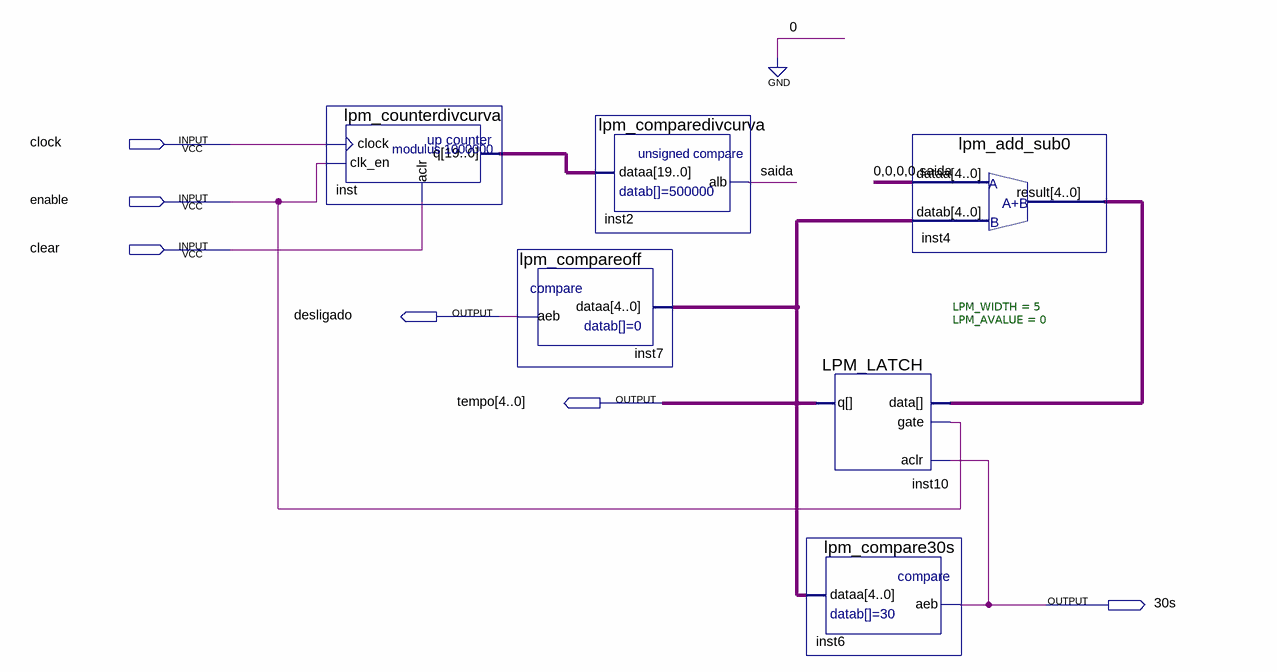
[diagram p0: schematic sheet]
// Quartus schematic tempo.bdf as structural Verilog: 6 symbols, 6 pins
module tempo (
  input  clock,
  input  enable,
  input  clear,
  output desligado,
  output [4:0] tempo,
  output \30s 
);

  wire saida;
  wire [4:0] inst4_result;
  wire [19:0] inst_q;

  lpm_counterdivcurva inst (.clock(clock), .clk_en(enable), .aclr(clear), .q(inst_q));
  lpm_compareoff inst7 (.dataa(tempo), .aeb(desligado));
  lpm_comparedivcurva inst2 (.dataa(inst_q), .alb(saida));
  LPM_LATCH #(.LPM_WIDTH(5), .LPM_AVALUE(0)) inst10 (.aclr(\30s ), .data(inst4_result), .gate(enable), .q(tempo));
  lpm_compare30s inst6 (.dataa(tempo), .aeb(\30s ));
  lpm_add_sub0 inst4 (.dataa({4'b0000, saida}), .datab(tempo), .result(inst4_result));
endmodule
